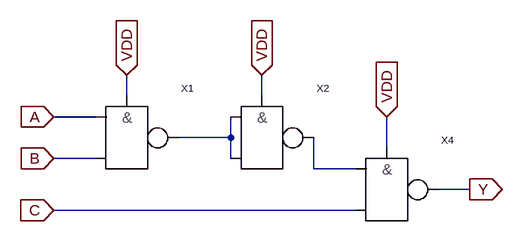
[diagram p0: schematic nand3.asc]
nand3.asc, the LTspice schematic file:
Version 4.1
SHEET 1 880 680
WIRE 176 16 176 -16
WIRE 384 16 384 -16
WIRE 128 48 64 48
WIRE 336 80 336 48
WIRE 336 80 256 80
WIRE 576 96 576 48
WIRE 128 112 64 112
WIRE 336 112 336 80
WIRE 464 128 464 80
WIRE 528 128 464 128
WIRE 704 160 656 160
WIRE 528 192 64 192
FLAG 64 48 A
IOPIN 64 48 In
FLAG 64 112 B
IOPIN 64 112 In
FLAG 64 192 C
IOPIN 64 192 In
FLAG 704 160 Y
IOPIN 704 160 Out
FLAG 384 -16 VDD
IOPIN 384 -16 In
FLAG 176 -16 VDD
IOPIN 176 -16 In
FLAG 576 48 VDD
IOPIN 576 48 In
SYMBOL nand2 176 80 R0
SYMATTR InstName X1
SYMBOL nand2 384 80 R0
SYMATTR InstName X2
SYMBOL nand2 576 160 R0
SYMATTR InstName X4

The netlist it stands for:
* nand3.asc
X§X1 VDD A B N001 nand2  ; pins VDD A B Y
X§X2 VDD N001 N001 N002 nand2  ; pins VDD A B Y
X§X4 VDD N002 C Y nand2  ; pins VDD A B Y
.backanno
.end